# Altium schematic sheet Coolant_Relays.SchDoc: STM32F446 CNC
size B; Author: AM; CompanyName: Expatria Technologies; DrawnBy: A.Marles; Engineer: AM; Organization: Expatria Technolgoies; DocumentNumber: 7; SheetNumber: 7; SheetTotal: 22
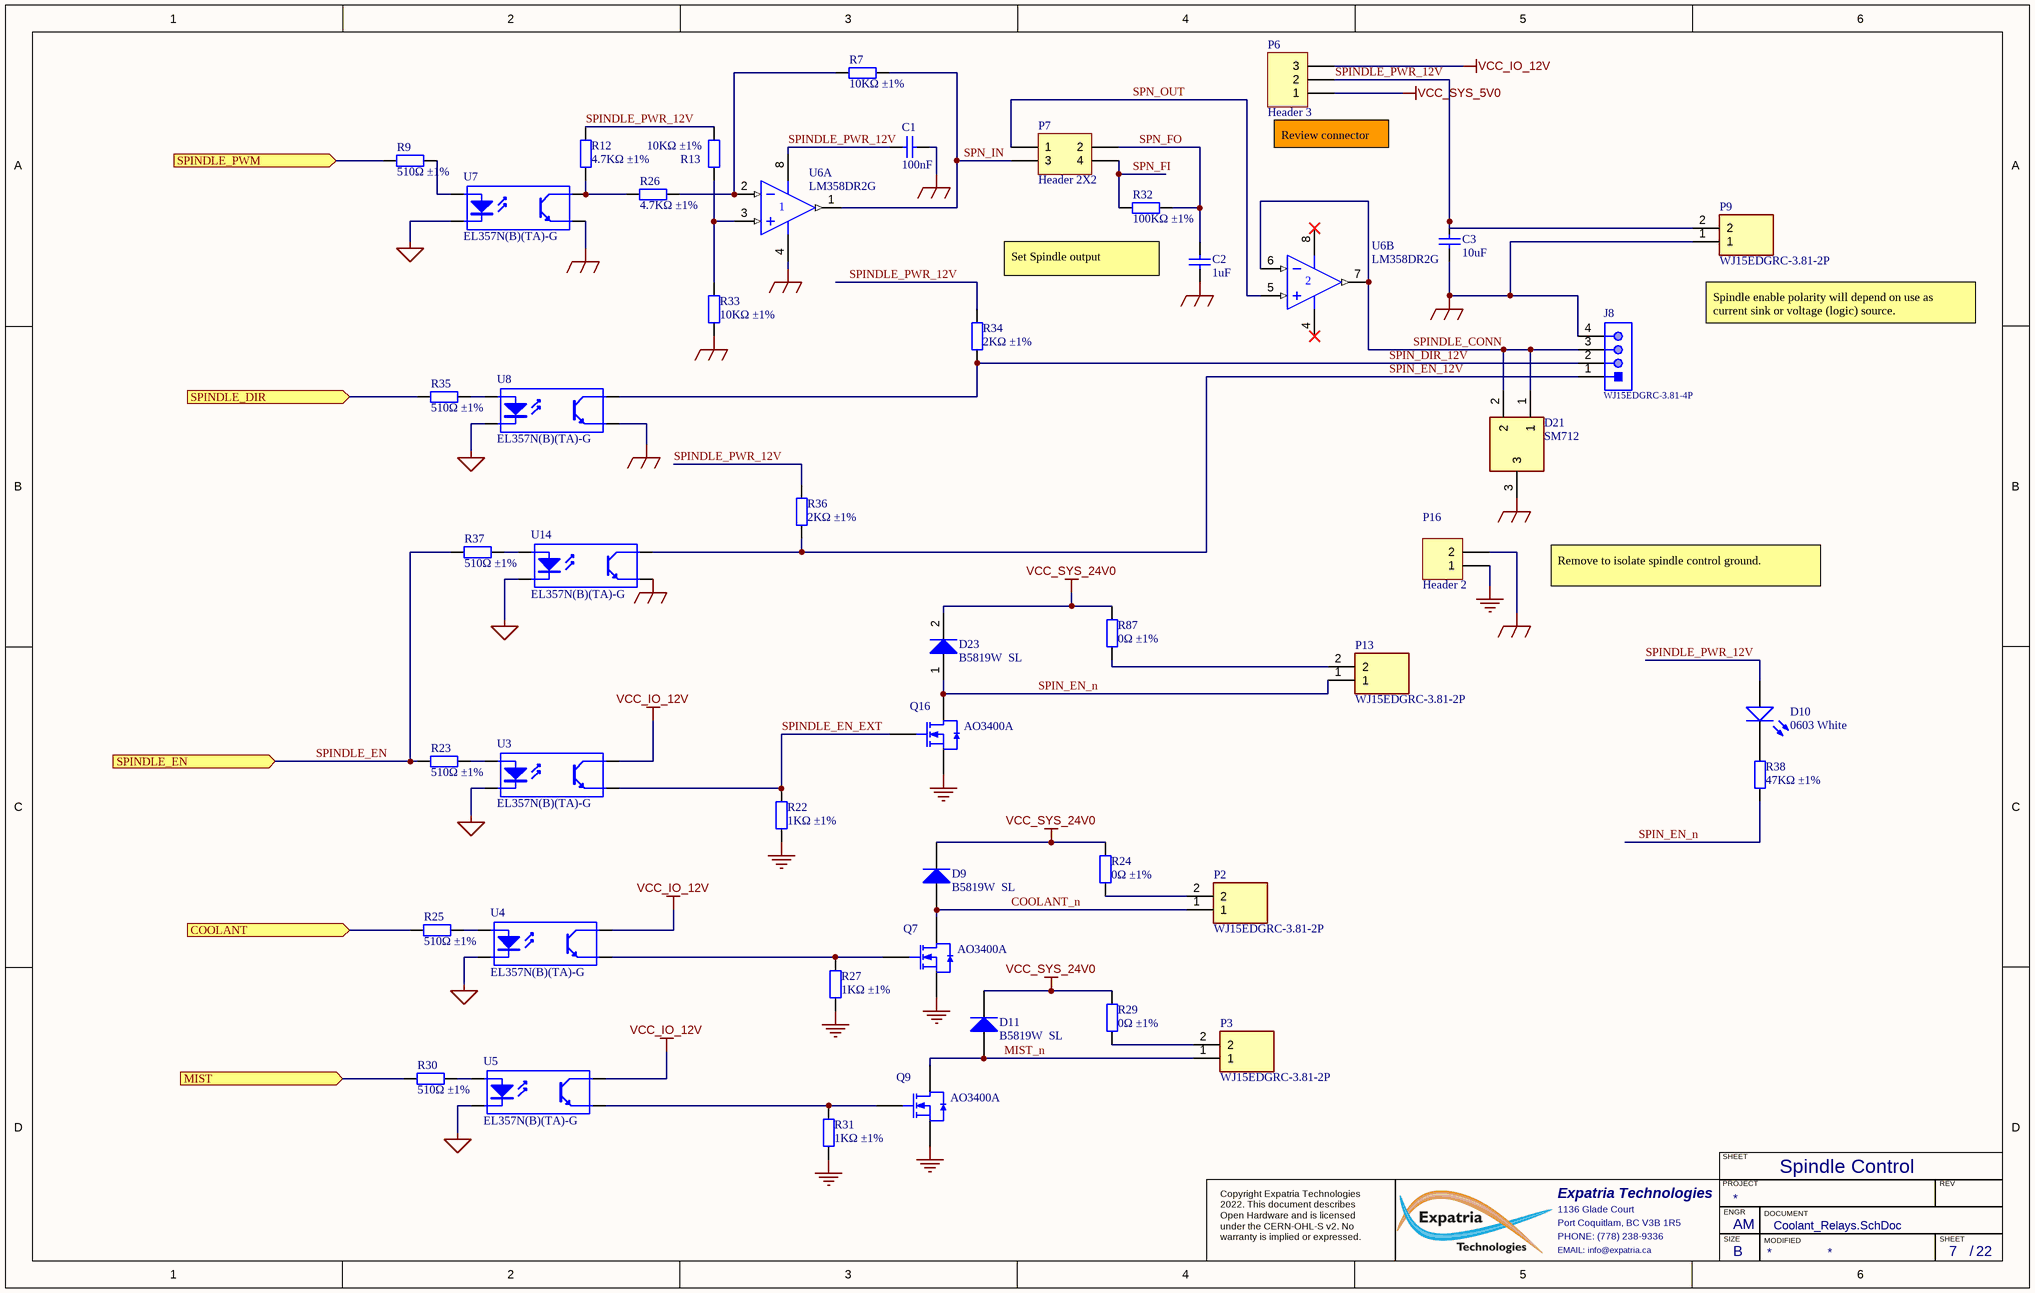
[diagram p0: Coolant_Relays.SchDoc]

## Parts
C1  100nF  [0603_C]
C2  1uF  [0603_C]
C3  10uF  [1206_C]
D9  B5819W  SL  [SOD-123]
D10  0603 White  [0603_LED_S1]
D11  B5819W  SL  [SOD-123]
D21  SM712  [SOT95P230X117-3N]
D23  B5819W  SL  [SOD-123]
J8  WJ15EDGRC-3.81-4P  [SHDRRA4W85P0X381_1X4_1612X915X720P]
P2  WJ15EDGRC-3.81-2P  [SHDRRA2W85P0X381_1X2_850X915X720P]
P3  WJ15EDGRC-3.81-2P  [SHDRRA2W85P0X381_1X2_850X915X720P]
P6  Header 3  [HDR1X3]
P7  Header 2X2  [HDR2X2]
P9  WJ15EDGRC-3.81-2P  [SHDRRA2W85P0X381_1X2_850X915X720P]
P13  WJ15EDGRC-3.81-2P  [SHDRRA2W85P0X381_1X2_850X915X720P]
P16  Header 2  [HDR1X2]
Q7  AO3400A  [SOT-23-3L]
Q9  AO3400A  [SOT-23-3L]
Q16  AO3400A  [SOT-23-3L]
R7  10KΩ ±1%  [0603_R]
R9  510Ω ±1%  [0603_R]
R12  4.7KΩ ±1%  [0603_R]
R13  10KΩ ±1%  [0603_R]
R22  1KΩ ±1%  [0603_R]
R23  510Ω ±1%  [0603_R]
R24  0Ω ±1%  [0603_R]
R25  510Ω ±1%  [0603_R]
R26  4.7KΩ ±1%  [0603_R]
R27  1KΩ ±1%  [0603_R]
R29  0Ω ±1%  [0603_R]
R30  510Ω ±1%  [0603_R]
R31  1KΩ ±1%  [0603_R]
R32  100KΩ ±1%  [0603_R]
R33  10KΩ ±1%  [0603_R]
R34  2KΩ ±1%  [0603_R]
R35  510Ω ±1%  [0603_R]
R36  2KΩ ±1%  [0603_R]
R37  510Ω ±1%  [0603_R]
R38  47KΩ ±1%  [0603_R]
R87  0Ω ±1%  [0603_R]
U3  EL357N(B)(TA)-G  [SOP-4_P2.54]
U4  EL357N(B)(TA)-G  [SOP-4_P2.54]
U5  EL357N(B)(TA)-G  [SOP-4_P2.54]
U6  LM358DR2G  [SOIC-8_150mil]  (parts A,B of 2)
U7  EL357N(B)(TA)-G  [SOP-4_P2.54]
U8  EL357N(B)(TA)-G  [SOP-4_P2.54]
U14  EL357N(B)(TA)-G  [SOP-4_P2.54]

## Ports
COOLANT (in), MIST (in), SPINDLE_DIR (in), SPINDLE_EN (in), SPINDLE_PWM (in)

## Nets
GND: P16.1 Q7.2(S) Q9.2(S) Q16.2(S) R22.1 R27.1 R31.1
MCU_GND: U3.2(K) U4.2(K) U5.2(K) U7.2(K) U8.2(K) U14.2(K)
SPIN_GND: C1.1 C2.1 C3.1 D21.3 J8.4 P9.1 P16.2 R33.2 U6.4(V-) U7.3(E) U8.3(E) U14.3(E)
VCC_IO_12V: P6.3 U3.4(C) U4.4(C) U5.4(C)
VCC_SYS_5V0: P6.1
VCC_SYS_24V0: D9.2(K) D11.2(K) D23.2(K) R24.1 R29.1 R87.1
COOLANT: R25.1 ; port COOLANT
COOLANT_n: D9.1(A) P2.1 Q7.3(D)
MIST: R30.1 ; port MIST
MIST_n: D11.1(A) P3.1 Q9.3(D)
SPIN_DIR_12V: J8.2 R34.1 U8.4(C)
SPIN_EN_12V: J8.1 R36.1 U14.4(C)
SPIN_EN_n: D23.1(A) P13.1 Q16.3(D) R38.1
SPINDLE_CONN: D21.1 D21.2 J8.3 U6.6(IN-) U6.7(OUT)
SPINDLE_DIR: R35.1 ; port SPINDLE_DIR
SPINDLE_EN: R23.1 R37.1 ; port SPINDLE_EN
SPINDLE_EN_EXT: Q16.1(G) R22.2 U3.3(E)
SPINDLE_PWM: R9.1 ; port SPINDLE_PWM
SPINDLE_PWR_12V: C1.2 C3.2 D10.A P6.2 P9.2 R12.1 R13.1 R34.2 R36.2 U6.8(V+)
SPN_FI: P7.4 R32.2
SPN_FO: C2.2 P7.2 R32.1
SPN_IN: P7.3 R7.2 U6.1(OUT)
SPN_OUT: P7.1 U6.5(IN+)
NetD10_K: D10.K R38.2
NetP2_2: P2.2 R24.2
NetP3_2: P3.2 R29.2
NetP13_2: P13.2 R87.2
NetQ7_1: Q7.1(G) R27.2 U4.3(E)
NetQ9_1: Q9.1(G) R31.2 U5.3(E)
NetR7_1: R7.1 R26.2 U6.2(IN-)
NetR9_2: R9.2 U7.1(A)
NetR12_2: R12.2 R26.1 U7.4(C)
NetR13_2: R13.2 R33.1 U6.3(IN+)
NetR23_2: R23.2 U3.1(A)
NetR25_2: R25.2 U4.1(A)
NetR30_2: R30.2 U5.1(A)
NetR35_2: R35.2 U8.1(A)
NetR37_2: R37.2 U14.1(A)

## Notes on the sheet
- (near P6) Review connector
- Set Spindle output
- (near P9) Spindle enable polarity will depend on use as current sink or voltage (logic) source.
- Remove to isolate spindle control ground.
- Spindle Control
- SHEET
- Expatria Technologies
- 1136 Glade Court
- Port Coquitlam, BC V3B 1R5
- PHONE: (778) 238-9336
- PROJECT
- SIZE
- ENGR
- MODIFIED
- DOCUMENT
- REV
- Copyright Expatria Technologies 2022. This document describes Open Hardware and is licensed under the CERN-OHL-S v2. No warranty is implied or expressed.
- EMAIL: info@expatria.ca
- B
- /

## Library data of the parts
C1 = 0603 100nF (104) 10% 50V: Chip capacitors; Manufacturer: YAGEO; PartNumber: CC0603KRX7R9BB104; Tolerance: 10%; Voltage: 50V; Package: 0603; Supplier: LC; SuppliersPartNumber: C14663; Capacitance: 100nF; Manufacturer 1: YAGEO
C2 = 0603 1uF (105) 10% 50V: Chip capacitors; Manufacturer: Samsung Electro-Mechanics; PartNumber: CL10A105KB8NNNC; Tolerance: 10%; Voltage: 50V; Package: 0603; Supplier: LC; SuppliersPartNumber: C15849; Capacitance: 1uF; Manufacturer 1: Samsung Electro-Mechanics
C3 = 1206 10uF (106) 10% 50V: Chip capacitors; Manufacturer: Samsung Electro-Mechanics; PartNumber: CL31A106KBHNNNE; Tolerance: 10%; Voltage: 50V; Package: 1206; Supplier: LC; SuppliersPartNumber: C13585; Capacitance: 10uF; Manufacturer 1: Samsung Electro-Mechanics
D9 D11 D23 = SOD-123 B5819W  SL: Schottky Diode; ComponentLink1Description: 供应商链接; ComponentLink1URL: http://www.szlcsc.com/product/details_9093.html; Package: SOD-123; Supplier: LC; SuppliersPartNumber: C8598
D10 = 19-217UWD/S365-2/TR8: LED; Package: 0603; Supplier: LC; SuppliersPartNumber: C133759; Color: White
D21 = CDSOT23-SM712: Bidirectional 12V (Max), 7V (Max) 7.5V / 13.3V 10V / 20V 12A(8/20us) SOT-23-3 TVS RoHS; Manufacturer_Name: DOWO; Height: 1.17mm; Manufacturer_Part_Number: SM712; SuppliersPartNumber: C293966; Manufacturer 1: DOWO; Manufacturer Part Number 1: SM712; Package: SOT-23-3
J8 = WJ15EDGRC-3.81-4P: 3.81mm Green Board Edge/Receptacle-Close Push-Pull,P=3.81mm Pluggable System Terminal Block ROHS; Manufacturer: Ningbo Kangnex Elec; SuppliersPartNumber: C7245; Supplier 1: LCSC; Supplier Part Number 1: C7245; Manufacturer Part Number: WJ15EDGRC-3.81-4P; RoHS: Yes; Category: Terminals
P2 P3 P9 P13 = WJ15EDGRC-3.81-2P: 3.81mm Green Board Edge/Receptacle-Close Push-Pull,P=3.81mm Pluggable System Terminal Block ROHS; Manufacturer_Name: Ningbo Kangnex; SuppliersPartNumber: C8387; Datasheet Link: https://datasheet.lcsc.com/szlcsc/Ningbo-Kangnex-Elec-WJ15EDGRC-3-81-2P_C8387.pdf; Height: 7.2mm; Manufacturer_Part_Number: WJ15EDGRC-3.81-2P
P6 = Header 3: Header, 3-Pin; Publisher: Altium Limited; SuppliersPartNumber: C49257
P7 = Header 2X2: Header, 2-Pin, Dual row; Supplier: LC; SuppliersPartNumber: C66690
P16 = Header 2: Header, 2-Pin; Publisher: Altium Limited; LatestRevisionDate: 17-Jul-2002; LatestRevisionNote: Re-released for DXP Platform.; SuppliersPartNumber: C234182
Q7 Q9 Q16 = AO3400A: MOSFET N-CH 30V 5.7A SOT23-3L; Manufacturer 1: Alpha & Omega Semicon; ComponentLink1Description: 供应商链接; ComponentLink1URL: http://www.szlcsc.com/product/details_21629.html; Package: SOT-23-3L; Supplier: LC; SuppliersPartNumber: C20917; Supplier 1: LC; Supplier Part Number 1: C20917; Manufacturer Part Number 1: AO3400A
R7 R13 R33 = 0603 10K (1002) 1%: Chip resistor; Manufacturer: Uniroyal Elec; PartNumber: 0603WAF1002T5E; Power: 1/10W; Package: 0603; Supplier: LC; SuppliersPartNumber: C25804; Resistance: 10KΩ; Tolerance: 1%; ComponentLink1Description: Supplier link; ComponentLink1URL: http://www.szlcsc.com/product/details_26547.html
R9 R23 R25 R30 R35 R37 = 0603 510R (5100) 1%: Chip resistor; Manufacturer: Uniroyal Elec; PartNumber: 0603WAF5100T5E; Power: 1/10W; Package: 0603; Supplier: LC; SuppliersPartNumber: C23193; Resistance: 510Ω; Tolerance: 1%; ComponentLink1Description: Supplier link; ComponentLink1URL: http://www.szlcsc.com/product/details_23920.html
R12 R26 = 0603 4.7K (4701) 1%: Chip resistor; Manufacturer: Uniroyal Elec; PartNumber: 0603WAF4701T5E; Power: 1/10W; Package: 0603; Supplier: LC; SuppliersPartNumber: C23162; Resistance: 4.7KΩ; Tolerance: 1%; ComponentLink1Description: Supplier link; ComponentLink1URL: http://www.szlcsc.com/product/details_23889.html
R22 R27 R31 = 0603 1K (1001) 1%: Chip resistor; Manufacturer: Uniroyal Elec; PartNumber: 0603WAF1001T5E; Power: 1/10W; ComponentLink1Description: Supplier link; ComponentLink1URL: http://www.szlcsc.com/product/details_21904.html; Package: 0603; Supplier: LC; SuppliersPartNumber: C21190; Resistance: 1KΩ; Tolerance: 1%
R24 R29 R87 = 0603 0R (0R0) 1%: Chip resistor; Manufacturer: Uniroyal Elec; PartNumber: 0603WAF0000T5E; Power: 1/10W; ComponentLink1Description: Supplier link; ComponentLink1URL: http://www.szlcsc.com/product/details_21903.html; Package: 0603; Supplier: LC; SuppliersPartNumber: C21189; Resistance: 0Ω; Tolerance: 1%
R32 = 0603 100K (1003) 1%: Chip resistor; Manufacturer: Uniroyal Elec; PartNumber: 0603WAF1003T5E; Power: 1/10W; Package: 0603; Supplier: LC; SuppliersPartNumber: C25803; Resistance: 100KΩ; Tolerance: 1%; ComponentLink1Description: Supplier link; ComponentLink1URL: http://www.szlcsc.com/product/details_26546.html
R34 R36 = 0603 2K (2001) 1%: Chip resistor; Manufacturer: Uniroyal Elec; PartNumber: 0603WAF2001T5E; Power: 1/10W; Package: 0603; Supplier: LC; SuppliersPartNumber: C22975; Resistance: 2KΩ; Tolerance: 1%; ComponentLink1Description: Supplier link; ComponentLink1URL: http://www.szlcsc.com/product/details_23702.html
R38 = 0603 47K (4702) 1%: Chip resistor; Manufacturer: Uniroyal Elec; PartNumber: 0603WAF4702T5E; Power: 1/10W; ComponentLink1Description: Supplier link; ComponentLink1URL: http://www.szlcsc.com/product/details_26562.html; Package: 0603; Supplier: LC; SuppliersPartNumber: C25819; Resistance: 47KΩ; Tolerance: 1%
U3-U5 U7 U8 U14 = EL357N(B)(TA)-G_[C6649]: OPTOISOLATOR 3.75KV TRANS 4-SOP; Manufacturer 1: Everlight Elec; Package: SOP-4_P2.54; Supplier: LC; SuppliersPartNumber: C6649; Manufacturer Part Number 1: EL357N(B)(TA)-G
  U3-U5: ComponentLink1Description: 供应商链接; ComponentLink1URL: http://www.szlcsc.com/product/details_7114.html
U6 = LM358DR2G_[C7950]: Dual Op Amp,  5 - 28 V,  8-PinSOIC; Manufacturer 1: ON Semiconductor; Package: SOIC-8; Supplier: LC; SuppliersPartNumber: C7950; Manufacturer Part Number 1: LM358DR2G; Packaging: Tape and Reel; Length: 5mm